# Altium schematic sheet Pg8.JTAG Interface + LEDs + Decoupling Capacitors.SchDoc: JTAG Interface + LEDs + Decoupling Capacitors
size 431 x 279 mm; Date: Not shown in title block; ApprovedBy: Not shown in title block; CheckedBy: Not shown in title block; Author: Not shown in title block; CompanyName: Not shown in title block; Engineer: Not shown in title block; Organization: Not shown in title block; Address1: Not shown in title block; Address2: Not shown in title block; Address3: Not shown in title block; Address4: Not shown in title block; DocumentNumber: 5; Revision: Use project parameter SCH_Rev; SheetNumber: 8; SheetTotal: 9; PageSetup: Record=PageOptions|CenterHorizontal=True|CenterVertical=True|PrintScale=1.00|XCorrection=1.00|YCorrection=1.00|PrintKind=0|BorderSize=5000000|LeftOffset=0|BottomOffset=0|Orientation=2|PaperLength=1000|PaperWidth=1000|Scale=100|PaperSource=15|PrintQuality=600|MediaType=1|DitherType=10|PaperKind=Letter|PrintScaleMode=1; CurrentTime: Not shown in title block; CurrentDate: Not shown in title block; Time: Not shown in title block; DocumentFullPathAndName: Not shown in title block; DocumentName: Not shown in title block; ModifiedDate: Not shown in title block; ImagePath: Not shown in title block
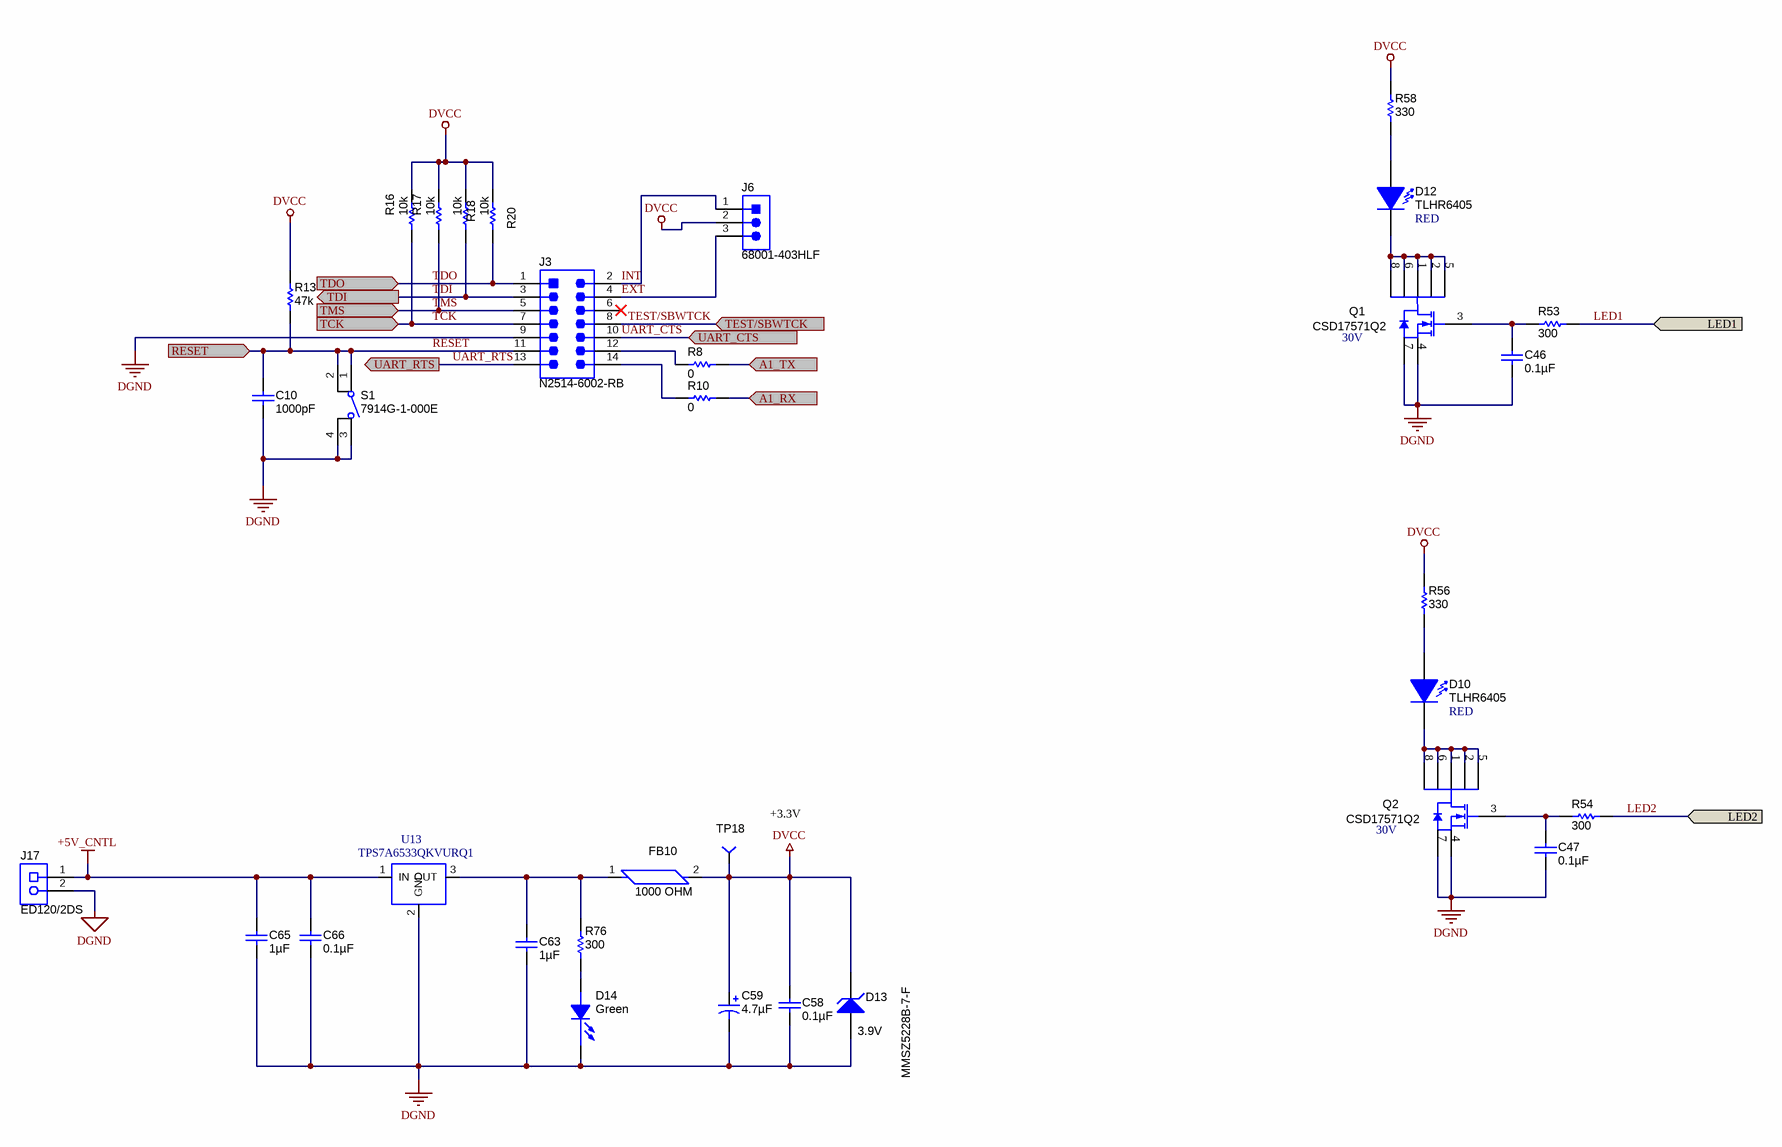
[diagram p0: Pg8.JTAG Interface + LEDs + Decoupling Capacitors.SchDoc]

## Parts
C10  ValueDisplayed: 1000pF  [0603]  (hidden comment: 06035A102KAT2A)
C46  ValueDisplayed: 0.1µF  [0603]  (hidden comment: 06033C104JAT2A)
C47  ValueDisplayed: 0.1µF  [0603]  (hidden comment: 06033C104JAT2A)
C58  ValueDisplayed: 0.1µF  [0603]  (hidden comment: C0603C104K5RACTU)
C59  ValueDisplayed: 4.7µF  [6032-28]  (hidden comment: 293D475X9035C2TE3)
C63  ValueDisplayed: 1µF  [0603]  (hidden comment: GRM188R71C105KA12D)
C65  ValueDisplayed: 1µF  [0603]  (hidden comment: GRM188R71C105KA12D)
C66  ValueDisplayed: 0.1µF  [0603]  (hidden comment: C0603C104K5RACTU)
D10  TLHR6405  value RED  [LED_5MM]
D12  TLHR6405  value RED  [LED_5MM]
D13  MMSZ5228B-7-F  value 3.9V  [sod-123]
D14  value Green  [LED0603AA]  (hidden comment: LED_LG L29K-G2J1-24-Z)
FB10  1000 OHM  [0603]
J3  N2514-6002-RB  [3M_N2514-6002-RB]
J6  68001-403HLF  [HDR1X3]
J17  ED120/2DS  [CONN_ED120-2DS]
Q1  CSD17571Q2  value 30V  [SON_CSD17571Q2]
Q2  CSD17571Q2  value 30V  [SON_CSD17571Q2]
R8  value 0  [0603]  (hidden comment: CRCW06030000Z0EA)
R10  value 0  [0603]  (hidden comment: CRCW06030000Z0EA)
R13  value 47k  [0603]  (hidden comment: CRCW060347K0JNEA)
R16  value 10k  [0603]  (hidden comment: CRCW060310K0JNEA)
R17  value 10k  [0603]  (hidden comment: CRCW060310K0JNEA)
R18  value 10k  [0603]  (hidden comment: CRCW060310K0JNEA)
R20  value 10k  [0603]  (hidden comment: CRCW060310K0JNEA)
R53  value 300  [0603]  (hidden comment: CRCW0603300RJNEA)
R54  value 300  [0603]  (hidden comment: CRCW0603300RJNEA)
R56  value 330  [0603]  (hidden comment: CRCW0603330RJNEA)
R58  value 330  [0603]  (hidden comment: CRCW0603330RJNEA)
R76  value 300  [0603]  (hidden comment: CRCW0603300RJNEA)
S1  7914G-1-000E  [SW_7914G-1-000E]
TP18  TP-040_RND  [TP-040_RND]  (value not drawn)
U13  TPS7A6533QKVURQ1  [KVU_1]

## Ports
A1_RX, A1_TX, LED1 (in), LED2 (in), RESET, TCK, TDI (out), TDO, TEST/SBWTCK, TMS, UART_CTS, UART_RTS

## Nets
+5V_CNTL: C65.1 C66.1 J17.1 U13.1(IN)
DGND: C10.2 C46.2 C47.2 C58.2 C59.2(-) C63.2 C65.2 C66.2 D13.2(A) D14.1(C) J3.9 J17.2 Q1.4(S) Q1.7(S) Q2.4(S) Q2.7(S) S1.3 S1.4 U13.2(GND)
DVCC: C58.1 C59.1(+) D13.1(K) FB10.2 J6.2 R13.2 R16.1 R17.1 R18.1 R20.1 R56.2 R58.2 TP18.1
A1_RX: R10.2 ; port A1_RX
A1_TX: R8.2 ; port A1_TX
EXT: J3.4 J6.3
INT: J3.2 J6.1
LED1: R53.1 ; port LED1
LED2: R54.1 ; port LED2
RESET: C10.1 J3.11 R13.1 S1.1 S1.2 ; port RESET
TCK: J3.7 R16.2 ; port TCK
TDI: J3.3 R18.2 ; port TDI
TDO: J3.1 R20.2 ; port TDO
TEST/SBWTCK: J3.8 ; port TEST/SBWTCK
TMS: J3.5 R17.2 ; port TMS
UART_CTS: J3.10 ; port UART_CTS
UART_RTS: J3.13 ; port UART_RTS
NetC46_1: C46.1 Q1.3(G) R53.2
NetC47_1: C47.1 Q2.3(G) R54.2
NetC63_1: C63.1 FB10.1 R76.2 U13.3(OUT)
NetD10_1: D10.1(K) Q2.1(D) Q2.2(D) Q2.5(D) Q2.6(D) Q2.8(D)
NetD10_2: D10.2(A) R56.1
NetD12_1: D12.1(K) Q1.1(D) Q1.2(D) Q1.5(D) Q1.6(D) Q1.8(D)
NetD12_2: D12.2(A) R58.1
NetD14_2: D14.2(A) R76.1
NetJ3_12: J3.12 R8.1
NetJ3_14: J3.14 R10.1

Not connected (* = marked no-connect by the designer): J3 6*

## Notes on the sheet
- (near TP18) +3.3V
- Drawn By:
- SVN Rev:
- Number:
- Rev:
- Sheet Title:
- File:
- Project Title:
- Designed for:
- Assembly Variant:
- Mod. Date:
- Sheet:
- Size:
- of
- B
- http://www.ti.com
- Texas Instruments and/or its licensors do not warrant the accuracy or completeness of this specification or any information contained therein. Texas Instruments and/or its licensors do not warrant that this design will meet the specifications, will be suitable for your application or fit for any particular purpose, or will operate in an implementation. Texas Instruments and/or its licensors do not warrant that the design is production worthy. You should completely validate and test your design implementation to confirm the system functionality for your application.
- Engineer:
- Contact:
- © Texas Instruments

## Library data of the parts
C10 = 06035A102KAT2A: CAP, CERM, 1000 pF, 50 V, +/- 10%, C0G/NP0, 0603; Manufacturer: AVX; Polarized: N; CompType: Capacitor; Value: 1000pF; U/M: EA; Cap_F: 0.000000001; Tolerance_%: 10; ESR_ohm: 0.048; Value1: 0.048 ohm; VDC_V: 50; Value2: 50V; TaMin_C: -55; TaMax_C: 125; SymbolVersion: 2008-07-09; PartNumber: 06035A102KAT2A; PackageReference: 0603; RoHS: Y; MountType: SMT; Technology: Ceramic; TempCo: C0G/NP0; Cap_Case: 0603; Published: 2008-06-19; Publisher: Texas Instruments; LatestRevisionDate: 2015-02-10; ComponentLink1Description: Datasheet link; ComponentLink1URL: http://www.avx.com/docs/masterpubs/smccp.pdf; Supplier 1: Digi-Key; Supplier Part Number 1: 478-3718-1-ND; Supplier 2: Mouser; Supplier Part Number 2: 581-06035A102KAT2A; Supplier 3: Farnell; Supplier Part Number 3: 1582693
C46 C47 = 06033C104JAT2A: CAP, CERM, 0.1uF, 25V, +/-5%, X7R, 0603; Manufacturer: AVX; Polarized: N; CompType: Capacitor; U/M: EA; Cap_F: 0.0000001; Tolerance_%: 5; ESR_Ohm: 0.05; Value1: 0.05 ohm; VDC_V: 25; TaMin_C: -55; TaMax_C: 125; SymbolVersion: 2008-07-09; Value: 0.1uF; PartNumber: 06033C104JAT2A; PackageReference: 0603; RoHS: Y; Value2: 25V; MountType: SMT; Technology: Ceramic; TempCo: X7R; Cap_Case: 0603; Published: 2008-06-19; Publisher: Texas Instruments; LatestRevisionDate: 2013-12-06; ComponentLink1Description: Datasheet link; ComponentLink1URL: http://www.avx.com/docs/masterpubs/smccp.pdf; Supplier 1: Digi-Key; Supplier Part Number 1: 478-3713-1-ND; Supplier 2: Mouser; Supplier Part Number 2: 581-06033C104JAT2A; Supplier 3: Farnell; Supplier Part Number 3: 1740614
C58 C66 = C0603C104K5RACTU: CAP, CERM, 0.1uF, 50V, +/-10%, X7R, 0603; Manufacturer: Kemet; Polarized: N; CompType: Capacitor; U/M: EA; Cap_F: 0.0000001; Tolerance_%: 10; Value1: Unknown; VDC_V: 50; TaMin_C: -55; TaMax_C: 125; SymbolVersion: 2008-07-09; Value: 0.1uF; PartNumber: C0603C104K5RACTU; PackageReference: 0603; RoHS: Y; Value2: 50V; MountType: SMT; Technology: Ceramic; TempCo: X7R; Cap_Case: 0603; Published: 2008-06-19; Publisher: Texas Instruments; LatestRevisionDate: 2013-11-21; ComponentLink1Description: Datasheet link; ComponentLink1URL: http://www.kemet.com/kemet/web/homepage/kechome.nsf/vapubfiles/F3102_Y5V.pdf/$file/F3102_Y5V.pdf; Supplier 1: Digi-Key; Supplier Part Number 1: 399-5089-1-ND; Supplier 2: Mouser; Supplier Part Number 2: 80-C0603C104K5R; Supplier 3: Farnell; Supplier Part Number 3: 1288255
C59 = 293D475X9035C2TE3: CAP, TA, 4.7uF, 35V, +/-10%, 1.9 ohm, SMD; Manufacturer: Vishay-Sprague; Polarized: Y; CompType: Capacitor; U/M: EA; Cap_F: 0.0000047; Tolerance_%: 10; Value1: 1.9 ohm; VDC_V: 35; ESR_Ohm: 1.9; IRMS_A: 0.24; TaMin_C: -55; TaMax_C: 125; Cap_Case: C; PackageReference: 6032-28; PartNumber: 293D475X9035C2TE3; SymbolVersion: 2008-07-09; Value: 4.7uF; RoHS: Y; Value2: 35V; MountType: SMT; Technology: TA; Series: 293D; Publisher: Texas Instruments; LatestRevisionDate: 2013-11-07; LatestRevisionNote: Updated supplier links; ComponentLink1Description: Datasheet link; ComponentLink1URL: http://www.vishay.com/docs/40002/293d.pdf; Supplier 1: Digi-Key; Supplier Part Number 1: 718-1083-1-ND; Supplier 2: Mouser; Supplier Part Number 2: 74-293D475X9035C2TE3; Supplier 3: Farnell; Supplier Part Number 3: 1612257
C63 C65 = GRM188R71C105KA12D: CAP, CERM, 1 µF, 16 V, +/- 10%, X7R, 0603; Manufacturer: MuRata; Polarized: N; CompType: Capacitor; Value: 1uF; U/M: EA; Cap_F: 0.000001; Tolerance_%: 10; ESR_ohm: 0.011; Value1: 0.011 ohm; VDC_V: 16; Value2: 16V; TaMin_C: -55; TaMax_C: 125; SymbolVersion: 2008-07-09; PartNumber: GRM188R71C105KA12D; PackageReference: 0603; RoHS: Y; MountType: SMT; Technology: Ceramic; TempCo: X7R; Cap_Case: 0603; Published: 2008-06-19; Publisher: Texas Instruments; LatestRevisionDate: 2015-02-10; ComponentLink1Description: Datasheet link; ComponentLink1URL: http://search.murata.co.jp/Ceramy/PnsearchViewAction.do?HnOFG=ON&HnNFG=ON&SEL_CNT=50&sLang=en&sKey=GRM188R71C105KA12D&x=9&y=9&search=startwith; Supplier 1: Digi-Key; Supplier Part Number 1: 490-3900-1-ND; Supplier 2: Mouser; Supplier Part Number 2: 81-GRM188R71C105KA12; Supplier 3: Farnell; Supplier Part Number 3: 1828826
D10 D12 = TLHR6405: LED, 5MM, RED, TH; Manufacturer: VISHAY; SymbolCreator: x0199378; PartNumber: TLHR6405; PackageReference: -; MountType: TH; RoHS: Y; ComponentLink1Description: Datasheet link; ComponentLink1URL: http://www.vishay.com/docs/83219/tlhg640.pdf; Alternate Manufacturer: -; Alternate PartNumber: -; SymbolVersion: 2014-04-10; Comp Type: LED; Supplier 1: Digi-key; Supplier Part Number 1: 751-1141-ND
D13 = 1SMB5915BT3G: DIODE ZENER 3.9V 500MW SOD123; Manufacturer: Diodes Incorporated; U/M: EA; Power_W: 0.55; Vz_V: 3.9; Value1: 0.55W; RJA_CperW: 226; PartNumber: MMSZ5228B-7-F; PackageReference: SOD123; CompType: Zener; Vr_V: N/A; MountType: SMT; RoHS: Y; ComponentLink1Description: Datasheet link; ComponentLink1URL: http://www.onsemi.com/pub_link/Collateral/1SMB5913BT3-D.PDF; Published: 2008-10-08; Publisher: Texas Instruments; LatestRevisionDate: 2014-05-12; LatestRevisionNote: Updated Supplier Data; Supplier 1: digikey; Supplier Part Number 1: MMSZ5228B-FDICT-ND
D14 = LED_LG L29K-G2J1-24-Z: LED SmartLED Green 570NM; Manufacturer: OSRAM; SymbolCreator: x0120606; CompType: *; PartNumber: LG L29K-G2J1-24-Z; Alternate Manufacturer: LED; PackageReference: 0603; ComponentLink1URL: http://catalog.osram-os.com/catalogue/catalogue.do;jsessionid=32CB61882C089EDD4B6D0A54E7E1F117?act=downloadFile&favOid=020000020000138e000100b6; Alternate PartNumber: *; ComponentLink1Description: Datasheet link; Supplier Part Number 1: 475-2709-1-ND; Supplier 1: Digi-Key; MountType: SMT; Publisher: TI
FB10 = MMZ1608B102C: FERRITE CHIP 1000 OHM 300MA 0603; Manufacturer: TDK Corporation; CompType: Ferrite Bead; PartNumber: MMZ1608B102C; MountType: SMT; Alternate PartNumber: *; Supplier 1: Digi-Key; ComponentLink1URL: http://www.tdk.co.jp/tefe02/e9412_mmz.pdf; ComponentLink1Description: Datasheet link; Publisher: TI; Supplier Part Number 1: 445-8672-1-ND; PackageReference: 0603; Value: 1000 OHM; Alternate Manufacturer: *; RoHS: Y
J3 = 0015912140: Header, 7x2, 100mil, SMT; Manufacturer: Molex; SymbolCreator: a0412235; U/M: EA; SymbolVersion: 2013-12-22; PartNumber: N2514-6002-RB; PackageReference: Header, 100 mil, 7x2, SMT; CompType: Header; RoHS: Y; MountType: SMT; ComponentLink1Description: Datasheet Link; ComponentLink1URL: http://www.molex.com/pdm_docs/sd/015912140_sd.pdf; Publisher: Texas Instruments; LatestRevisionDate: 2014-05-15; Supplier 1: Digi-Key; Supplier Part Number 1: MHC14K-ND
J6 = 009155003301006: 3 pin berger; Manufacturer: FCI; SymbolCreator: a0799628; CompType: Connector; U/M: EA; SymbolVersion: 2013-03-28; PartNumber: 68001-403HLF; PackageReference: Connector,RA, Battery 3Pos, 3mm Pitch; RoHS: Y; MountType: SMT; ComponentLink1Description: Datasheet Link; ComponentLink1URL: http://www.avx.com/docs/catalogs/9155-5.pdf; Publisher: Texas Instruments; LatestRevisionDate: 2014-05-15; Supplier 1: Digi-Key; Supplier Part Number 1: 609-3471-ND; Supplier 2: Mouser
J17 = ED120/2DS: TERMINAL BLOCK 5.08MM VERT 2POS, TH; Manufacturer: On-Shore Technology; SymbolCreator: a0412235; U/M: EA; SymbolVersion: 2013-09-04; PartNumber: ED120/2DS; PackageReference: TERM_BLK, 2pos, 5.08mm; CompType: Terminal Block; RoHS: Y; MountType: TH; ComponentLink1Description: Datasheet Link; ComponentLink1URL: http://www.on-shore.com/sites/default/files/manuals/ed120ds.pdf; Publisher: Texas Instruments; LatestRevisionDate: 2013-12-06; Supplier 1: Digi-Key; Supplier Part Number 1: ED1609-ND
Q1 Q2 = CSD17571Q2: MOSFET, N-CH, 30V, 22A, SON 2X2 MM; Manufacturer: TEXAS INSTRUMENTS; CompType: POWER MOSFET; Alternate Manufacturer: -; Alternate PartNumber: -; ComponentLink1Description: Datasheet Link; ComponentLink1URL: http://www.ti.com/general/docs/lit/getliterature.tsp?genericPartNumber=csd17571q2&fileType=pdf; MountType: SMT; PackageReference: DQK; PartNumber: CSD17571Q2; RoHS: Y; SymbolCreator: -; SymbolVersion: 2014-01-06
R8 R10 = CRCW06030000Z0EA: RES, 0 ohm, 5%, 0.1W, 0603; Manufacturer: Vishay-Dale; CompType: Resistor; Value_Code: 0000; Tolerance_%: 5; Power_W: 0.1; VDC_V: 75; TempCo: 200 ppm/C; EIA_Code: E24; U/M: EA; SymbolVersion: 2009-05-29; PartNumber: CRCW06030000Z0EA; PackageReference: 0603; RoHS: Y; Res_ohm: 0; Value1: 5%; Value2: 0.1W; MountType: SMT; Technology: Thick Film; Published: 2008-06-26; Publisher: Texas Instruments; LatestRevisionDate: 2014-05-20; ComponentLink1Description: Datasheet link; ComponentLink1URL: http://www.vishay.com/docs/20035/dcrcwe3.pdf; Supplier 1: Digi-Key; Supplier Part Number 1: 541-0.0GCT-ND; Supplier 2: Mouser; Supplier Part Number 2: 71-CRCW0603-0-E3; Supplier 3: Farnell; Supplier Part Number 3: 1469739
R13 = CRCW060347K0JNEA: RES, 47k ohm, 5%, 0.1W, 0603; Manufacturer: Vishay-Dale; CompType: Resistor; Res_ohm: 47000; Value_Code: 47k0; Tolerance_%: 5; Power_W: 0.1; VDC_V: 75; TempCo: 200 ppm/C; EIA_Code: E24; U/M: EA; SymbolVersion: 2009-05-29; PartNumber: CRCW060347K0JNEA; PackageReference: 0603; RoHS: Y; Value1: 5%; Value2: 0.1W; MountType: SMT; Technology: Thick Film; Published: 2008-06-26; Publisher: Texas Instruments; LatestRevisionDate: 2014-04-18; ComponentLink1Description: Datasheet link; ComponentLink1URL: http://www.vishay.com/docs/20035/dcrcwe3.pdf; Supplier 1: Digi-Key; Supplier Part Number 1: 541-47KGCT-ND; Supplier 2: Mouser; Supplier Part Number 2: 71-CRCW060347K0JNEA; Supplier 3: Farnell; Supplier Part Number 3: 1652881
R16-R18 R20 = RNCF0603TKY10K0: RES 10K OHM 1/10W 5% 0603 SMD; Manufacturer: Vishay-Dale; CompType: Resistor; Res_ohm: 10000; Value_Code: 10k0; Tolerance_%: 0.01; Value1: 0.01%; Power_W: 0.063; Value2: 0.063W; VDC_V: 50; TempCo: 5 ppm/C; U/M: EA; SymbolVersion: 2009-05-29; PartNumber: CRCW060310K0JNEA; PackageReference: 0603; RoHS: Y; MountType: SMT; Technology: Thin Film; Published: 2008-06-26; Publisher: Texas Instruments; LatestRevisionDate: 2013-10-22; ComponentLink1Description: Datasheet link; ComponentLink1URL: http://www.seielect.com/Catalog/SEI-RNCF.pdf; Supplier 1: Digi-Key; Supplier Part Number 1: 541-10KGCT-ND
R53 R54 R76 = CRCW0603300RJNEA: RES, 300 ohm, 5%, 0.1W, 0603; Manufacturer: Vishay-Dale; CompType: Resistor; Value_Code: 300R; Tolerance_%: 5; Power_W: 0.1; VDC_V: 75; TempCo: 200 ppm/C; EIA_Code: E24; U/M: EA; PartNumber: CRCW0603300RJNEA; SymbolVersion: 2009-05-29; PackageReference: 0603; RoHS: Y; Res_ohm: 300; Value1: 5%; Value2: 0.1W; MountType: SMT; Technology: Thick Film; Published: 2008-06-26; Publisher: Texas Instruments; LatestRevisionDate: 2013-10-22; ComponentLink1Description: Datasheet link; ComponentLink1URL: http://www.vishay.com/docs/20035/dcrcwe3.pdf; Supplier 1: Digi-Key; Supplier Part Number 1: 541-300GCT-ND; Supplier 2: Mouser; Supplier Part Number 2: 71-CRCW0603J-300-E3; Supplier 3: Farnell; Supplier Part Number 3: 1514755
R56 R58 = CRCW0603330RJNEA: RES, 330 ohm, 5%, 0.1W, 0603; Manufacturer: Vishay-Dale; CompType: Resistor; Value_Code: 330R; Tolerance_%: 5; Power_W: 0.1; VDC_V: 75; TempCo: 200 ppm/C; EIA_Code: E24; U/M: EA; SymbolVersion: 2009-05-29; PartNumber: CRCW0603330RJNEA; PackageReference: 0603; RoHS: Y; Res_ohm: 330; Value1: 5%; Value2: 0.1W; MountType: SMT; Technology: Thick Film; Published: 2008-06-26; Publisher: Texas Instruments; LatestRevisionDate: 2014-05-20; ComponentLink1Description: Datasheet link; ComponentLink1URL: http://www.vishay.com/docs/20035/dcrcwe3.pdf; Supplier 1: Digi-Key; Supplier Part Number 1: 541-330GCT-ND; Supplier 2: Mouser; Supplier Part Number 2: 71-CRCW0603J-330-E3; Supplier 3: Farnell; Supplier Part Number 3: 1692522
S1 = 7914G-1-000E: Switch, Tactile, SPST-NO, 0.1A, 16V, SMT; Manufacturer: Bourns; SymbolCreator: a0412235; VDC_V: 16; SwitchFunction: Off-Mom; PositionCount: 1; CurrentRating_mA: 100; SymbolVersion: 2013-06-27; PartNumber: 7914G-1-000E; MountType: SMT; ComponentLink1Description: Datasheet URL; ComponentLink1URL: http://www.bourns.com/data/global/pdfs/7914.pdf; RoHS: Y; Circuit: SPST-NO; Orientation: Top Actuated; CompType: Switch; PackageReference: 4.93x4.19x6.2 mm; Publisher: Texas Instruments; LatestRevisionDate: 2014-05-08; Supplier 1: Digi-Key; Supplier Part Number 1: 7914G-000ECT-ND; Supplier 2: Mouser; Supplier Part Number 2: 652-7914G-1-000E; Supplier 3: Farnell; Supplier Part Number 3: 1607971
TP18 = TP-040_RND: Test Point, O.040 Hole; Manufacturer: STD; Value: STD; area: *; SymbolVersion: 06/30/2008 16:03:57; PartNumber: STD; ComponentLink1Description: AEO Datasheet Link
U13 = TPS7A6533QKVURQ1: IC, 300-mA 40-V LOW-DROPOUT REGULATOR WITH 25-uA QUIESCENT CURRENT; Manufacturer: TI; Alternate Manufacturer: None; Area: 136210; ComponentLink1URL: \\vette02\pmp_pcb\pcad_pdf's\tps7a6533-q11.pdf; SymbolVersion: 08/11/2011 09:47:42; PackageReference: PFM; PartNumber: TPS7A6533QKVURQ1; Value: TPS7A6533QKVURQ1; ComponentLink1Description: AEO Datasheet Link